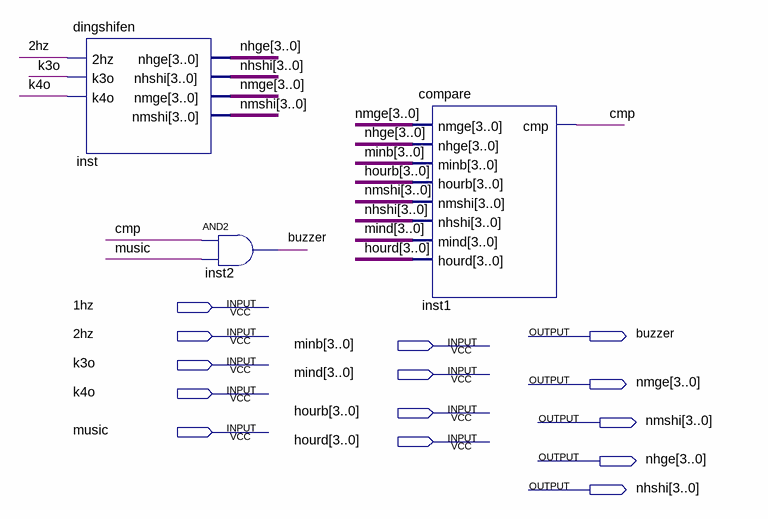
[diagram p0: schematic sheet]
// Quartus schematic alarm.bdf as structural Verilog: 3 symbols, 14 pins
module alarm (
  input  \1hz ,
  input  \2hz ,
  input  [3:0] minb,
  input  k3o,
  input  [3:0] mind,
  input  k4o,
  input  [3:0] hourb,
  input  music,
  input  [3:0] hourd,
  output buzzer,
  output [3:0] nmge,
  output [3:0] nmshi,
  output [3:0] nhge,
  output [3:0] nhshi
);

  wire cmp;

  dingshifen inst (.\2hz (\2hz ), .k3o(k3o), .k4o(k4o), .nhge(nhge), .nhshi(nhshi), .nmge(nmge), .nmshi(nmshi));
  and inst2 (buzzer, cmp, music);
  compare inst1 (
    .nmge(nmge), .nhge(nhge), .minb(minb), .hourb(hourb), .nmshi(nmshi), .nhshi(nhshi), .mind(mind),
    .hourd(hourd), .cmp(cmp));
endmodule
